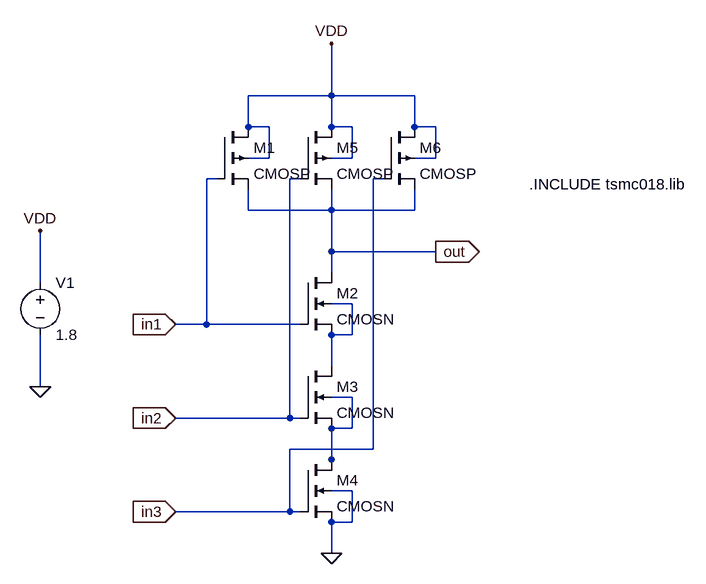
[diagram p0: schematic nand3.asc]
nand3.asc, the LTspice schematic file:
Version 4
SHEET 1 880 788
WIRE 304 64 304 -16
WIRE 304 64 176 64
WIRE 432 64 304 64
WIRE 176 112 176 64
WIRE 208 112 176 112
WIRE 304 112 304 64
WIRE 336 112 304 112
WIRE 432 112 432 64
WIRE 464 112 432 112
WIRE 208 160 208 112
WIRE 208 160 176 160
WIRE 336 160 336 112
WIRE 336 160 304 160
WIRE 464 160 464 112
WIRE 464 160 432 160
WIRE 128 192 112 192
WIRE 256 192 240 192
WIRE 384 192 368 192
WIRE 176 240 176 208
WIRE 304 240 304 208
WIRE 304 240 176 240
WIRE 432 240 432 208
WIRE 432 240 304 240
WIRE 304 304 304 240
WIRE 464 304 304 304
WIRE 304 336 304 304
WIRE -144 352 -144 272
WIRE 336 384 304 384
WIRE 112 416 112 192
WIRE 112 416 64 416
WIRE 256 416 112 416
WIRE 336 432 336 384
WIRE 336 432 304 432
WIRE 304 480 304 432
WIRE -144 512 -144 432
WIRE 336 528 304 528
WIRE 240 560 240 192
WIRE 240 560 64 560
WIRE 256 560 240 560
WIRE 336 576 336 528
WIRE 336 576 304 576
WIRE 368 608 368 192
WIRE 368 608 240 608
WIRE 304 624 304 576
WIRE 304 640 304 624
WIRE 336 672 304 672
WIRE 240 704 240 608
WIRE 240 704 64 704
WIRE 256 704 240 704
WIRE 336 720 336 672
WIRE 336 720 304 720
WIRE 304 768 304 720
FLAG 304 -16 VDD
FLAG 64 416 in1
IOPIN 64 416 In
FLAG 464 304 out
IOPIN 464 304 Out
FLAG -144 512 0
FLAG -144 272 VDD
FLAG 64 560 in2
IOPIN 64 560 In
FLAG 64 704 in3
IOPIN 64 704 In
FLAG 304 768 0
SYMBOL cmosp 128 112 R0
SYMATTR InstName M1
SYMATTR Value2 l=180n w=360n
SYMBOL cmosn 256 336 R0
SYMATTR InstName M2
SYMATTR Value2 l=180n w=180n
SYMBOL voltage -144 336 R0
WINDOW 123 0 0 Left 0
WINDOW 39 0 0 Left 0
SYMATTR InstName V1
SYMATTR Value 1.8
SYMBOL cmosn 256 480 R0
SYMATTR InstName M3
SYMATTR Value2 l=180n w=180n
SYMBOL cmosn 256 624 R0
SYMATTR InstName M4
SYMATTR Value2 l=180n w=180n
SYMBOL cmosp 256 112 R0
SYMATTR InstName M5
SYMATTR Value2 l=180n w=360n
SYMBOL cmosp 384 112 R0
SYMATTR InstName M6
SYMATTR Value2 l=180n w=360n
TEXT 608 200 Left 2 !.INCLUDE tsmc018.lib

The netlist it stands for:
* nand3.asc
M1 VDD in1 out VDD CMOSP l=180n w=360n
M2 out in1 N001 N001 CMOSN l=180n w=180n
V1 VDD 0 1.8
M3 N001 in2 N002 N002 CMOSN l=180n w=180n
M4 N002 in3 0 0 CMOSN l=180n w=180n
M5 VDD in2 out VDD CMOSP l=180n w=360n
M6 VDD in3 out VDD CMOSP l=180n w=360n
.model NMOS NMOS
.model PMOS PMOS
.lib standard.mos
.INCLUDE tsmc018.lib
.backanno
.end